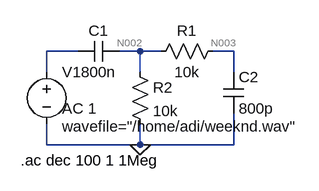
[diagram p0: schematic Draft4.asc]
Draft4.asc, the LTspice schematic file:
Version 4.1
SHEET 1 880 680
WIRE 96 112 48 112
WIRE 192 112 160 112
WIRE 224 112 192 112
WIRE 336 112 304 112
WIRE 48 144 48 112
WIRE 192 144 192 112
WIRE 336 144 336 112
WIRE 48 256 48 224
WIRE 192 256 192 224
WIRE 192 256 48 256
WIRE 336 256 336 208
WIRE 336 256 192 256
FLAG 192 256 0
SYMBOL cap 160 96 R90
WINDOW 0 0 32 VBottom 2
WINDOW 3 32 32 VTop 2
SYMATTR InstName C1
SYMATTR Value 800n
SYMBOL res 320 96 R90
WINDOW 0 0 56 VBottom 2
WINDOW 3 32 56 VTop 2
SYMATTR InstName R1
SYMATTR Value 10k
SYMBOL res 176 128 R0
SYMATTR InstName R2
SYMATTR Value 10k
SYMBOL voltage 48 128 R0
WINDOW 3 24 100 Left 2
WINDOW 123 24 72 Left 2
SYMATTR InstName V1
SYMATTR Value wavefile="/home/adi/weeknd.wav"
SYMATTR Value2 AC 1
SYMBOL cap 320 144 R0
SYMATTR InstName C2
SYMATTR Value 800p
TEXT 8 280 Left 2 !.ac dec 100 1 1Meg

The netlist it stands for:
* Draft4.asc
C1 N002 N001 800n
R1 N003 N002 10k
R2 N002 0 10k
V1 N001 0 wavefile="/home/adi/weeknd.wav" AC 1
C2 N003 0 800p
.ac dec 100 1 1Meg
.backanno
.end

* Results of the author's LTspice run, read from the files saved beside the schematic
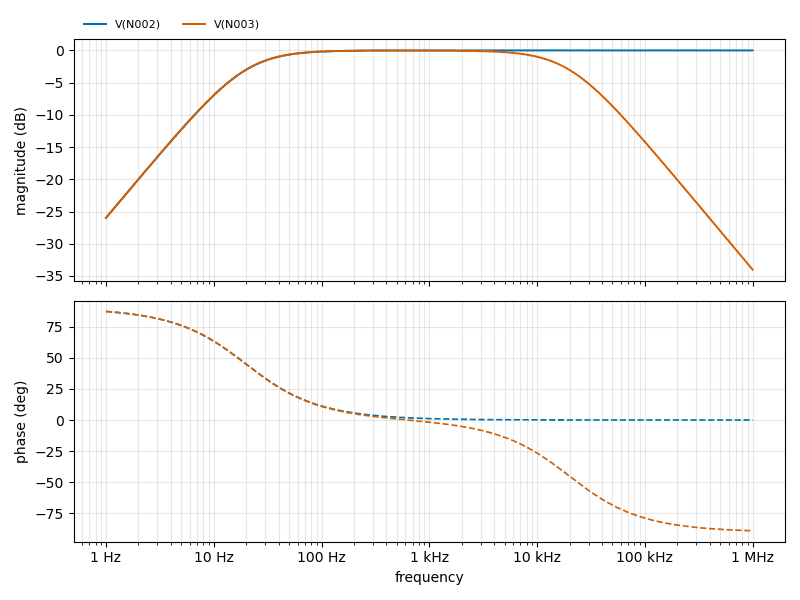
[diagram p1: AC Analysis of Draft4.asc, plotted from the saved traces]
* AC Analysis, 1 run:
*   V(N002): -25.99 dB at 1 Hz, -0.00 dB at 1 MHz, peak -0.00 dB at 1 MHz, 3 dB below the peak at 19.91 Hz
*   V(N003): -25.99 dB at 1 Hz, -34.03 dB at 1 MHz, peak -0.02 dB at 631 Hz, 3 dB below the peak at 19.84 Hz and 19.95 kHz